# Altium schematic sheet Power_3.3V.SchDoc
size B
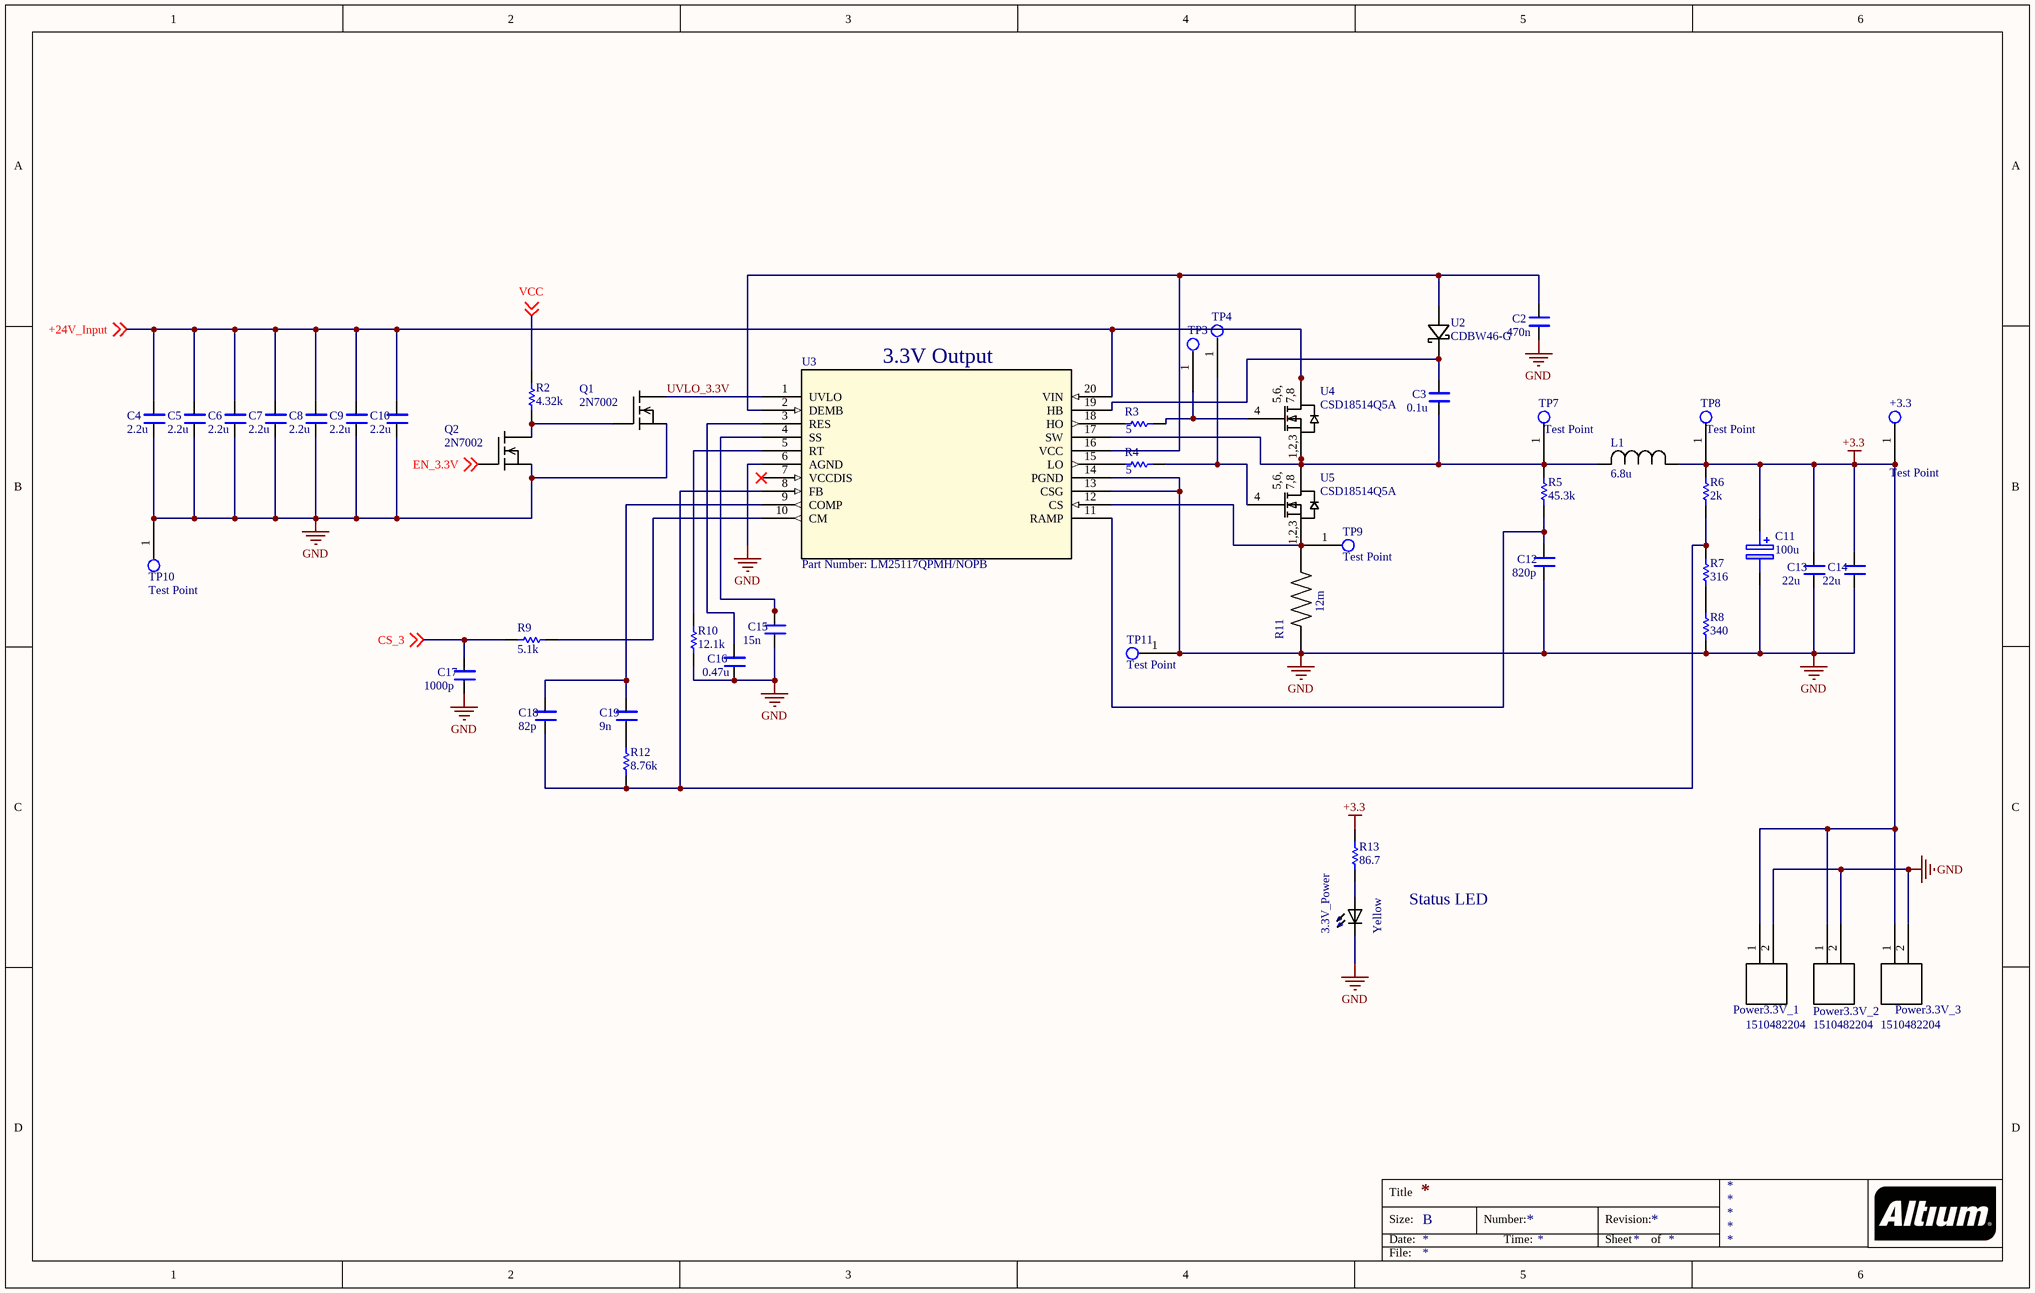
[diagram p0: Power_3.3V.SchDoc]

## Parts
3.3V_Power  Yellow  [*DIOC200X125X110_LTST-C171KSKT(Primary)]
+3.3  Test Point  [Test Point Through-hole]
C2  470n  [*CAPC2012X88N]
C3  0.1u  [*CAPC2012X88N]
C4  2.2u  [*CAPC2012X88N]
C5  2.2u  [*CAPC2012X88N]
C6  2.2u  [*CAPC2012X88N]
C7  2.2u  [*CAPC2012X88N]
C8  2.2u  [*CAPC2012X88N]
C9  2.2u  [*CAPC2012X88N]
C10  2.2u  [*CAPC2012X88N]
C11  100u  [CAPPRD500W65D1000H1800]
C12  820p  [*CAPC2012X88N]
C13  22u  [*CAPC2012X88N]
C14  22u  [*CAPC2012X88N]
C15  15n  [*CAPC2012X88N]
C16  0.47u  [*CAPC2012X88N]
C17  1000p  [*CAPC2012X88N]
C18  82p  [*CAPC2012X88N]
C19  9n  [*CAPC2012X88N]
L1  6.8u  [IND_BOURNS_SRP12]
Power3.3V_1  1510482204  [1510482204]
Power3.3V_2  1510482204  [1510482204]
Power3.3V_3  1510482204  [1510482204]
Q1  2N7002  [*SOT23]
Q2  2N7002  [*SOT23]
R2  4.32k  [RESC0805(2012)_M]
R3  5  [AXIAL-0.3]
R4  5  [AXIAL-0.3]
R5  45.3k  [RESC0805(2012)_M]
R6  2k  [RESC0805(2012)_M]
R7  316  [RESC0805(2012)_M]
R8  340  [RESC0805(2012)_M]
R9  5.1k  [RESC0805(2012)_M]
R10  12.1k  [RESC0805(2012)_M]
R11  12m  [*RESC6432X110N]
R12  8.76k  [RESC0805(2012)_M]
R13  86.7  [RESC0805(2012)_M]
TP3  (no value)  [Test Point Through-hole]
TP4  (no value)  [Test Point Through-hole]
TP7  Test Point  [Test Point Through-hole]
TP8  Test Point  [Test Point Through-hole]
TP9  Test Point  [Test Point Through-hole]
TP10  Test Point  [Test Point Through-hole]
TP11  Test Point  [Test Point Through-hole]
U2  CDBW46-G  [CDBW]
U3  Part Number: LM25117QPMH/NOPB  [MXA20A]
U4  CSD18514Q5A  [DQJ0008A]
U5  CSD18514Q5A  [DQJ0008A]

## Nets
+3.3: +3.3.1 C11.1(+) C13.2 C14.2 L1.1 Power3.3V_1.1 Power3.3V_2.1 Power3.3V_3.1 R6.2 R13.2 TP8.1
GND: 3.3V_Power.NEG C2.1 C4.1 C5.1 C6.1 C7.1 C8.1 C9.1 C10.1 C11.2(-) C12.1 C13.1 C14.1 C15.1 C16.1 C17.1 Power3.3V_1.2 Power3.3V_2.2 Power3.3V_3.2 Q1.2(S) Q2.2(S) R8.1 R10.1 R11.1 TP10.1 TP11.1 U3.6(AGND) U3.13(CSG) U3.14(PGND)
+24V_Input: C4.2 C5.2 C6.2 C7.2 C8.2 C9.2 C10.2 U3.20(VIN) U4.5(D) U4.6(D) U4.7(D) U4.8(D) ; off-sheet +24V_Input
CS_3: C17.2 R9.2 ; off-sheet CS_3
EN_3.3V: Q2.1(G) ; off-sheet EN_3.3V
UVLO_3.3V: Q1.3(D) U3.1(UVLO)
VCC: R2.2 ; off-sheet VCC
Net3.3V_Power_POS: 3.3V_Power.POS R13.1
NetC2_2: C2.2 U2.2 U3.2(DEMB) U3.16(VCC)
NetC3_1: C3.1 L1.2 R5.2 TP7.1 U3.17(SW) U4.1(S) U4.2(S) U4.3(S) U5.5(D) U5.6(D) U5.7(D) U5.8(D)
NetC3_2: C3.2 U2.1 U3.19(HB)
NetC12_2: C12.2 R5.1 U3.11(RAMP)
NetC15_2: C15.2 U3.4(SS)
NetC16_2: C16.2 U3.3(RES)
NetC18_1: C18.1 R6.1 R7.2 R12.1 U3.8(FB)
NetC18_2: C18.2 C19.2 U3.9(COMP)
NetC19_1: C19.1 R12.2
NetQ1_1: Q1.1(G) Q2.3(D) R2.1
NetR3_1: R3.1 U3.18(HO)
NetR3_2: R3.2 TP3.1 U4.4(G)
NetR4_1: R4.1 U3.15(LO)
NetR4_2: R4.2 TP4.1 U5.4(G)
NetR7_1: R7.1 R8.2
NetR9_1: R9.1 U3.10(CM)
NetR10_2: R10.2 U3.5(RT)
NetR11_2: R11.2 TP9.1 U3.12(CS) U5.1(S) U5.2(S) U5.3(S)

Not connected (* = marked no-connect by the designer): U3 7(VCCDIS)*

## Notes on the sheet
- (near U3) 3.3V Output
- Status LED
- Title
- Size:
- Date:
- B
- Number:
- Time:
- Revision:
- Sheet
- of
- File:
- (in symbol CSD18514Q5A) 5,6,; 7,8; 1,2,3

## Library data of the parts
3.3V_Power = LTST-C171KSKT: / Yellow 2 x 1.25 x 0.8 mm 130Â° Water Clear 50 mcd 2 V LED SMT /; MF: Lite-On Inc.; SnapEDA_Link: https://www.snapeda.com/parts/LTST-C171KSKT/Lite-On%20Inc./view-part/?ref=snap; Package: 0805 Lite-On; MP: LTST-C171KSKT; Digi-Key_Part_Number: 160-1428-1-ND; Digi-Key_Purchase_URL: https://www.digikey.com/product-detail/en/lite-on-inc/LTST-C171KSKT/160-1428-1-ND/386802?utm_source=snapeda&utm_medium=aggregator&utm_campaign=symbol; Value: *
C2-C10 C12-C19 = C0805C101JAGAC7800: / 100pF Â±5% 250V Ceramic Capacitor C0G, NP0 0805 _2012 Metric_ /; MF: KEMET; Package: 0805 KEMET; Digi-Key_Part_Number: 399-15000-1-ND; MP: C0805C101JAGAC7800; Digi-Key_Purchase_URL: https://www.digikey.com/product-detail/en/kemet/C0805C101JAGAC7800/399-15000-1-ND/7382549?utm_source=snapeda&utm_medium=aggregator&utm_campaign=symbol; SnapEDA_Link: https://www.snapeda.com/parts/C0805C101JAGAC7800/KEMET/view-part/3661430/?ref=snap; Value: *
C11 = EEUFC1V331: FC radial elec cap,330uF 35V Panasonic Aluminium Electrolytic Capacitor 330F 35 V dc 10mm Through Hole series FC Radial lifetime 3000h; Allied_Number: 70068521; Geometry.Height: 18mm; Manufacturer_Name: Panasonic; Manufacturer_Part_Number: EEUFC1V331; RS Part Number: 1081337; RS Price/Stock: http://uk.rs-online.com/web/p/products/1081337; Allied Price/Stock: https://www.alliedelec.com/panasonic-eeufc1v331/70068521/; Mouser Part Number: 1081337; Mouser Price/Stock: http://uk.rs-online.com/web/p/products/1081337; Datasheet Link: https://industrial.panasonic.com/cdbs/www-data/pdf/RDF0000/ABA0000C1209.pdf
L1 = SRP1270-6R8M: No Description Available; Vendor: Bourns Electronics; Built_By: EMA_UL_Team; Type: DEV; Manufacturer_Part_Number: SRP1270-6R8M; Copyright: Copyright (C) 2018 Accelerated Designs. All rights reserved; RefDes: RefDes; Value: Value
Power3.3V_1-Power3.3V_3 = 1510482204: Molex 6.5MM 2 pin connector, used for power connections. P/N 1510482204 and similar models.
Q1 Q2 = 2N7002: Trans MOSFET N-CH 60V 0.115A 3-Pin SOT-23 T/R; MF: ON Semiconductor; Price: None; SnapEDA_Link: https://www.snapeda.com/parts/2N7002/ON%20Semiconductor/view-part/4449003/?ref=snap; Availability: Unavailable; Package: SOT-23-3 ON Semiconductor; MP: 2N7002; Value: *
R2 R5-R10 R12 R13 = CMP-1013-00951-1: 8M06 0.125W 1% 0805 (2012 Metric)  SMD; Value: 8060000.00 Ohm; Case-EIA: 0805; Case-Metric: 2012; Power: 0.125 W; Technology: SMT; Tolerance: 1 %
R3 R4 = 120R 5% 0805: 120R 0.125W 5% 0805 (2012 Metric)  SMD; Case-Metric: 2012; Value: 120.00 Ohm; Case-EIA: 0805; Tolerance: 5 %; Technology: SMT; Power: 0.125 W
R11 = ERJ-M1WSF12MU: Res Thick Film 2512 0.012 Ohm 1% 1W Pad SMD Automotive T/R; MF: Panasonic; MP: ERJ-M1WSF12MU; Package: 6432 Panasonic Electronic Components; Digi-Key_Purchase_URL: https://www.digikey.com/product-detail/en/panasonic-electronic-components/ERJ-M1WSF12MU/P12MCT-ND/300474?utm_source=snapeda&utm_medium=aggregator&utm_campaign=symbol; Digi-Key_Part_Number: P12MCT-ND; SnapEDA_Link: https://www.snapeda.com/parts/ERJ-M1WSF12MU/Panasonic/view-part/?ref=snap; Value: *
TP3 TP4 = Test Point
U2 = CDBW46-G: No Description Available; Vendor: Comchip; Built_By: EMA_UL_Team; Manufacturer_Part_Number: CDBW46-G; Copyright: Copyright (C) 2018 Accelerated Designs. All rights reserved; RefDes: RefDes; Type: DEV; Value: Value
U3 = LM25117QPMH/NOPB: No Description Available; Manufacturer: Texas Instruments; Built_By: EMA_UL_Team; Manufacturer_Part_Number: LM25117QPMH/NOPB; Vendor: Texas Instruments; Copyright: Copyright (C) 2018 Accelerated Designs. All rights reserved; RefDes: RefDes; Type: DEV; Value: Value
U4 U5 = CSD18514Q5A: No Description Available; Vendor: Texas Instruments; Built_By: Texas_Instrument_Team; Value: 40V; VALUE_2: Value; Manufacturer_Part_Number: CSD18514Q5A; Copyright: Copyright (C) 2018 Accelerated Designs. All rights reserved; RefDes: RefDes; Type: DEV